# Altium schematic sheet main.SchDoc: GMAO IoT
size A3; Author: Alejandro Lemos; Organization: Protipark; Address1: Somewhere; Address2: Colombia; Address4: Open Hardware; DocumentNumber: 1; Revision: A; SheetNumber: 1; SheetTotal: 1
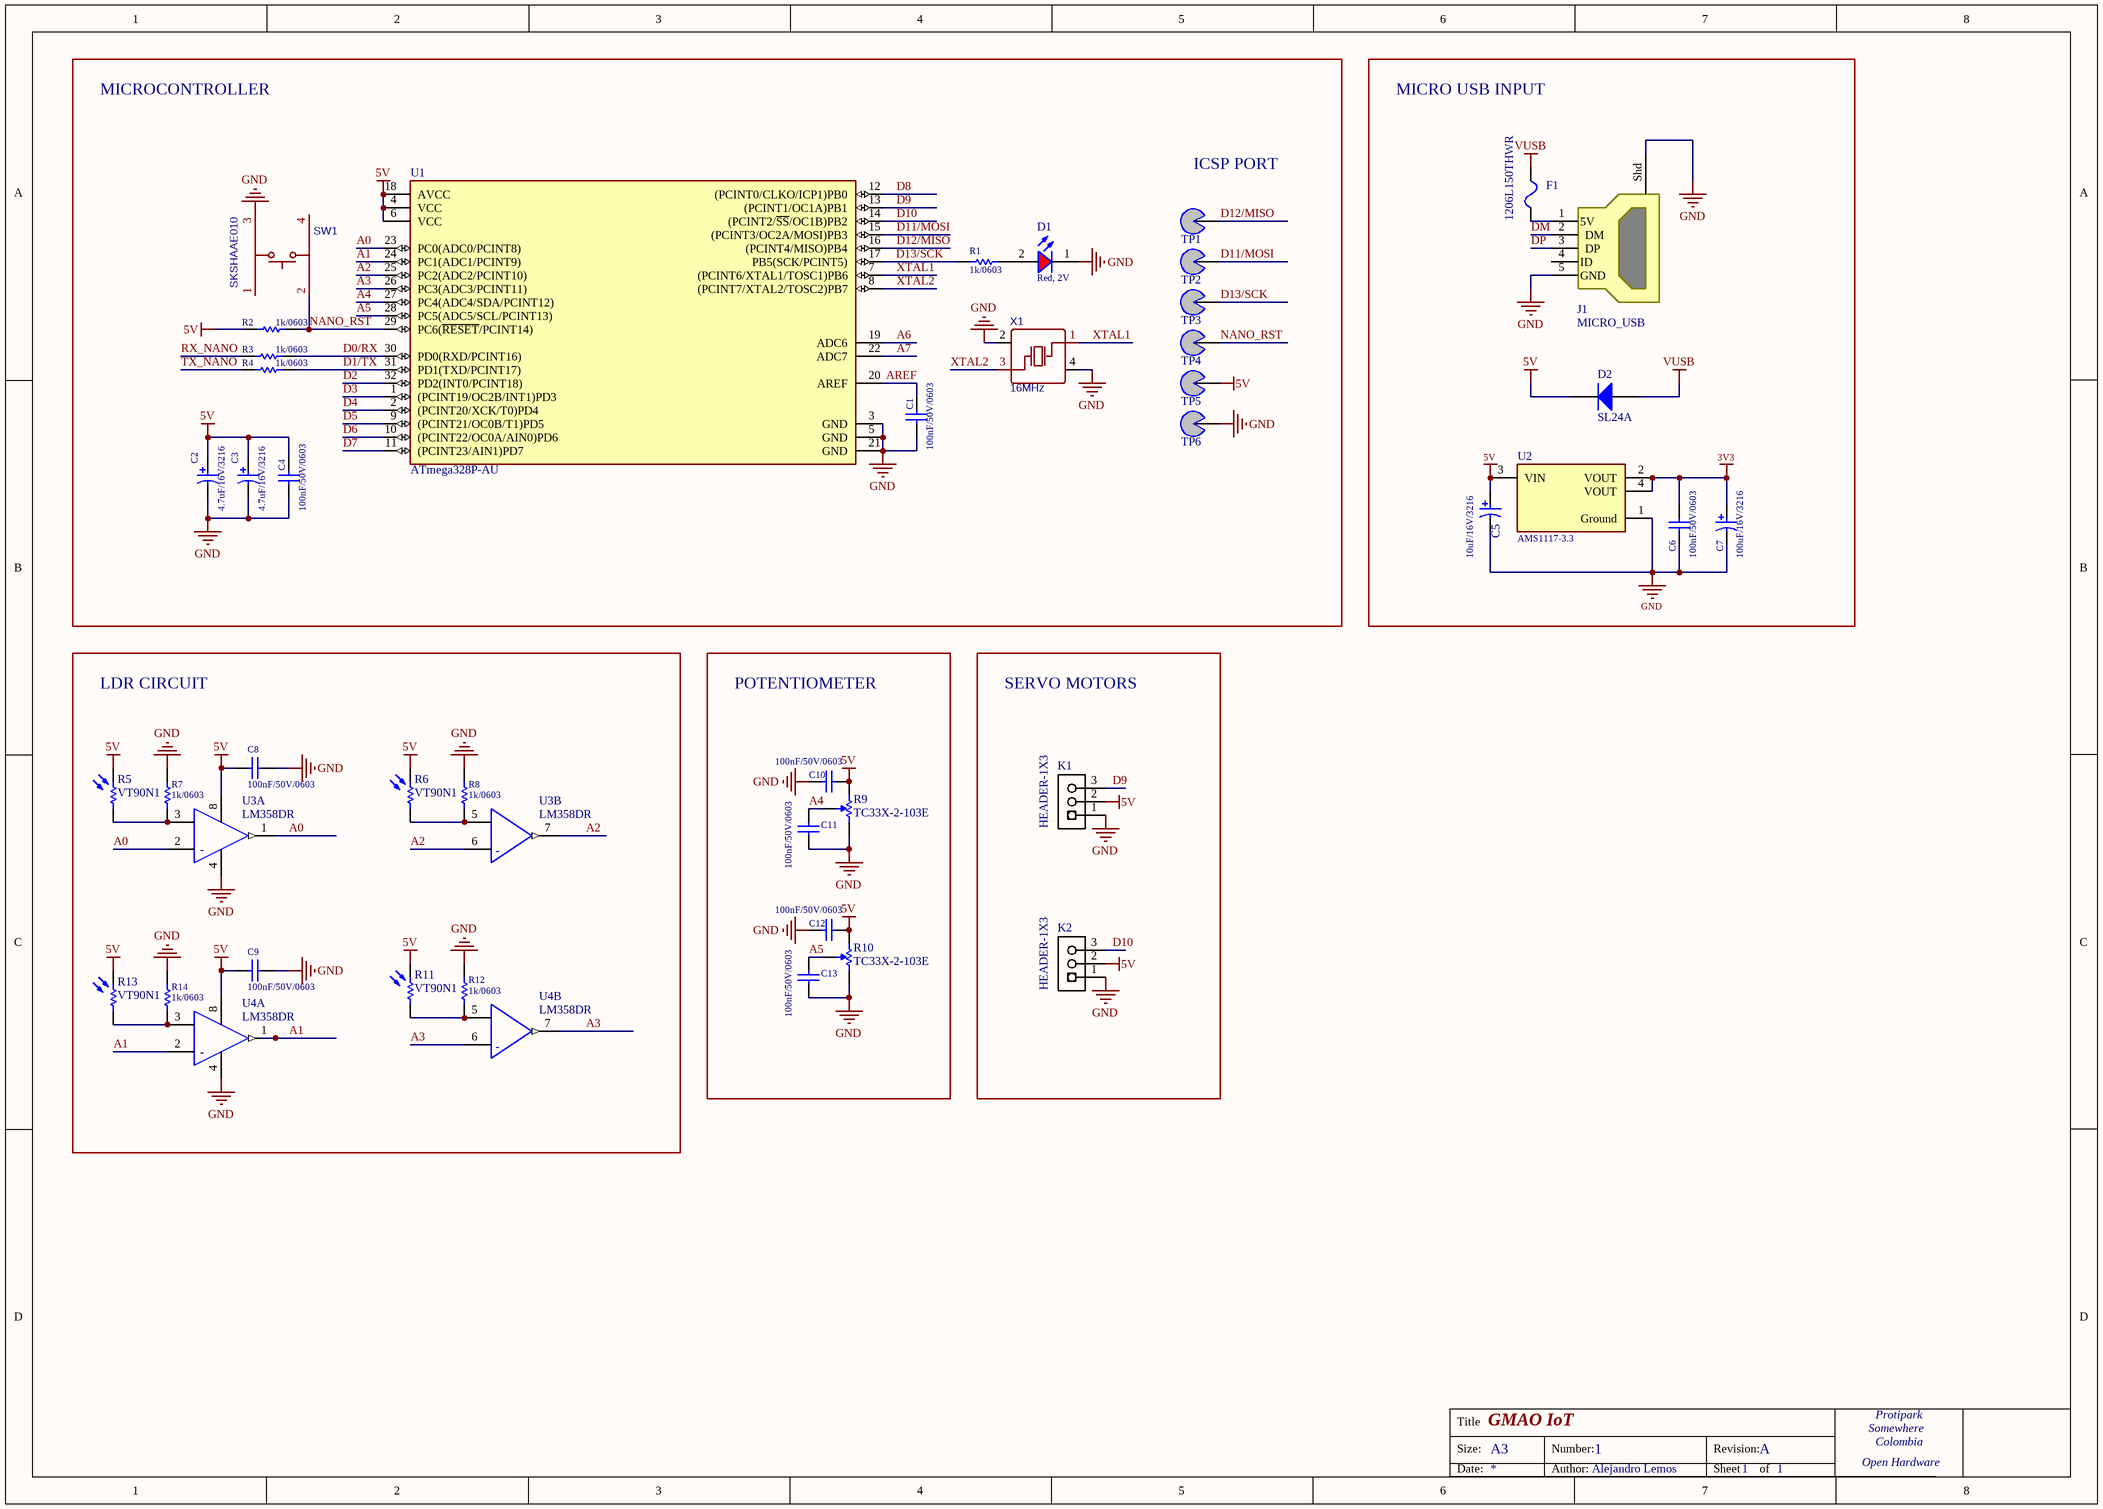
[diagram p0: main.SchDoc]

## Parts
C1  100nF/50V/0603  [C0603_L]
C2  4.7uF/16V/3216  [KEMT-T491-A_L]
C3  4.7uF/16V/3216  [KEMT-T491-A_L]
C4  100nF/50V/0603  [C0603_L]
C5  10uF/16V/3216  [KEMT-T491-A_L]
C6  100nF/50V/0603  [C0603_L]
C7  100uF/16V/3216  [KEMT-T491-A_L]
C8  100nF/50V/0603  [C0603_L]
C9  100nF/50V/0603  [C0603_L]
C10  100nF/50V/0603  [C0603_L]
C11  100nF/50V/0603  [C0603_L]
C12  100nF/50V/0603  [C0603_L]
C13  100nF/50V/0603  [C0603_L]
D1  Red, 2V  [WL-SMCW_0603_H=0.7mm]
D2  SL24A  [GESC-GAP3SLT33-214-2_V]
F1  1206L150THWR  [R1206_L]
J1  MICRO_USB  [USB MICRO]
K1  HEADER-1X3  [HEADER-1X3]
K2  HEADER-1X3  [HEADER-1X3]
R1  1k/0603  [R0603_N]
R2  1k/0603  [R0603_N]
R3  1k/0603  [R0603_N]
R4  1k/0603  [R0603_N]
R5  VT90N1  [EXCE-VT90N1]
R6  VT90N1  [EXCE-VT90N1]
R7  1k/0603  [R0603_N]
R8  1k/0603  [R0603_N]
R9  TC33X-2-103E  [BOUR-TC33X-2_V]
R10  TC33X-2-103E  [BOUR-TC33X-2_V]
R11  VT90N1  [EXCE-VT90N1]
R12  1k/0603  [R0603_N]
R13  VT90N1  [EXCE-VT90N1]
R14  1k/0603  [R0603_N]
SW1  SKSHAAE010  [SW-SMD_4P-L3.2-W2.9-P2.20-LS3.4]
TP1  Test_Point  [TESTPOINT_PROG]  (value not drawn)
TP2  Test_Point  [TESTPOINT_PROG]  (value not drawn)
TP3  Test_Point  [TESTPOINT_PROG]  (value not drawn)
TP4  Test_Point  [TESTPOINT_PROG]  (value not drawn)
TP5  Test_Point  [TESTPOINT_PROG]  (value not drawn)
TP6  Test_Point  [TESTPOINT_PROG]  (value not drawn)
U1  ATmega328P-AU  [FP-32A-MFG]
U2  AMS1117-3.3  [FP-AMS1117-IPC_C]
U3  LM358DR  [FP-D0008A-MFG]  (parts A,B of 2)
U4  LM358DR  [FP-D0008A-MFG]  (parts A,B of 2)
X1  16MHz  [CRYSTAL-SMD_4P-L3.2-W2.5-BL]

## Blocks framed on the sheet
MICRO USB INPUT: C5-C7 D2 F1 J1 U2
LDR CIRCUIT: C8 C9 R5-R8 R11-R14 U3 U4
POTENTIOMETER: C10-C13 R9 R10
SERVO MOTORS: K1 K2

## Nets
3V3: C6.2 C7.1 U2.2(VOUT) U2.4(VOUT)
5V: C2.1 C3.1 C4.2 C5.1 C8.2 C9.2 C10.2 C12.2 D2.2(K) K1.2 K2.2 R2.1 R5.2 R6.2 R9.1 R10.1 R11.2 R13.2 TP5.0(TP) U1.4(VCC) U1.6(VCC) U1.18(AVCC) U2.3(VIN) U3.8(V+) U4.8(V+)
GND: C1.2 C2.2 C3.2 C4.1 C5.2 C6.1 C7.2 C8.1 C9.1 C10.1 C11.1 C12.1 C13.1 D1.1(K) J1.5(GND) J1.Shd K1.1 K2.1 R7.1 R8.1 R9.3 R10.3 R12.1 R14.1 SW1.3 TP6.0(TP) U1.3(GND) U1.5(GND) U1.21(GND) U2.1(Ground) U3.4(V-) U4.4(V-) X1.2(GND) X1.4(GND)
VUSB: D2.1(A) F1.2
A0: U1.23(PC0(ADC0/PCINT8)) U3.1(1OUT) U3.2(IN1-)
A1: U1.24(PC1(ADC1/PCINT9)) U4.1(1OUT) U4.2(IN1-)
A2: U1.25(PC2(ADC2/PCINT10)) U3.6(IN2-) U3.7(2OUT)
A3: U1.26(PC3(ADC3/PCINT11)) U4.6(IN2-) U4.7(2OUT)
A4: C11.2 R9.2 U1.27(PC4(ADC4/SDA/PCINT12))
A5: C13.2 R10.2 U1.28(PC5(ADC5/SCL/PCINT13))
A6: U1.19(ADC6)
A7: U1.22(ADC7)
AREF: C1.1 U1.20(AREF)
D0/RX: R3.2 U1.30(PD0(RXD/PCINT16))
D1/TX: R4.2 U1.31(PD1(TXD/PCINT17))
D2: U1.32(PD2(INT0/PCINT18))
D3: U1.1((PCINT19/OC2B/INT1)PD3)
D4: U1.2((PCINT20/XCK/T0)PD4)
D5: U1.9((PCINT21/OC0B/T1)PD5)
D6: U1.10((PCINT22/OC0A/AIN0)PD6)
D7: U1.11((PCINT23/AIN1)PD7)
D8: U1.12((PCINT0/CLKO/ICP1)PB0)
D9: K1.3 U1.13((PCINT1/OC1A)PB1)
D10: K2.3 U1.14((PCINT2/~{SS}/OC1B)PB2)
D11/MOSI: TP2.0(TP) U1.15((PCINT3/OC2A/MOSI)PB3)
D12/MISO: TP1.0(TP) U1.16((PCINT4/MISO)PB4)
D13/SCK: R1.2 TP3.0(TP) U1.17(PB5(SCK/PCINT5))
DM: J1.2(DM)
DP: J1.3(DP)
NANO_RST: R2.2 SW1.2 TP4.0(TP) U1.29(PC6(~{RESET}/PCINT14))
RX_NANO: R3.1
TX_NANO: R4.1
XTAL1: U1.7((PCINT6/XTAL1/TOSC1)PB6) X1.1(OSC1)
XTAL2: U1.8((PCINT7/XTAL2/TOSC2)PB7) X1.3(OSC2)
NetD1_2: D1.2(A) R1.1
NetF1_1: F1.1 J1.1(5V)
NetR5_1: R5.1 R7.2 U3.3(IN1+)
NetR6_1: R6.1 R8.2 U3.5(IN2+)
NetR11_1: R11.1 R12.2 U4.5(IN2+)
NetR13_1: R13.1 R14.2 U4.3(IN1+)

Not connected (* = marked no-connect by the designer): J1 4(ID); SW1 1 4

## Notes on the sheet
- MICROCONTROLLER
- (near TP1) ICSP PORT
- Title
- Size:
- A3
- Number:
- Revision:
- Date:
- Author:
- Sheet
- of
- (in symbol CMP-1685-00009-2, part A) -
- (in symbol CMP-1685-00009-2, part B) -

## Library data of the parts
C1 C4 C6 C8-C13 = C_SMD: Value: 100nF/50V/0603
C2 C3 C5 C7 = CMP-2000-07187-1: Tantalum Capacitor, 2.2 uF, +/- 10%, 16 V, -55 to 125 degC, 2-Pin SMD, RoHS, Tape and Reel; Manufacturer: Kemet; Capacitance: 2200000pF; Product Depth (mm): 1.6mm; DCL: 0.4uA; Wire Form: NotRequired; Case Style: Molded; ESR: 6ohm; Polarity: Polar; Product Length (mm): 3.2mm; Voltage: 16VDC; Lead Spacing (nom): NotRequiredmm; DF: 6%; Rad Hardened: No; Operating Temp Range: -55Cto125C; Datasheet Version: 10/2016; Packaging: TapeandReel; Mounting Style: SurfaceMount; Manufacturer URL: http://www.kemet.com/; Seal: NotRequired; Product Height (mm): 1.6mm; Construction: SMTChip; Length W/Weld: NotRequiredmm; Package Reference: T491-A; Package Description: 2-Pin Surface Mount Device, Body 3.2 x 1.6 mm; Tolerance (+ or -): 10%; Length W/Weld (max): NotRequiredmm; Insulation: NotRequired; Mounting Technology: SurfaceMount; Package / Case: 3216-18; Seated Plane Height: NotRequiredmm; Case Code: A; Datasheet URL: http://capacitoredge.kemet.com/capedge2/DataSheet/Datasheet-T491A225K016AT.pdf?pn=T491A225K016AT; Product Diameter (mm): NotRequiredmm; Failure Rate: NotRequired
D1 = 150060RS75000: WL-SMCW SMT Mono-color Chip LED Waterclear, size 0603, Red, 2V, 140deg; Chip Technology: AlInGaP; Dominant Wavelength typ.: 625nm; Luminous Intensity typ.: 250mcd; Peak Wavelength typ.: 630nm; Viewing Angle: 140deg; ComponentLink1Description: Manufacturer; ComponentLink1URL: http://www.we-online.de; ComponentLink2URL: https://www.we-online.com/catalog/datasheet/150060RS75000.pdf; ComponentLink2Description: Datasheet; Forward Voltage typ.: 2V; Emitting Color: Red; Mounting Technology: SMT; Operating Temperature: -40 to +85degC; Published Date: December 2019; Part Number: 150060RS75000; Packaging: Tape and Reel; Size: 0603; Publisher: Wurth Elektronik
D2 = CMP-2000-05135-2: 40V 2A 420mV @ 2A SMA(DO-214AC) Schottky Barrier Diodes (SBD) RoHS; Pd - Power Dissipation: 25W; Configuration: Single; Vrrm - Repetitive Reverse Voltage: 3300V; Unit Weight: 0.003284oz; trr - Reverse Recovery time: 60ns; Brand: GeneSiCSemiconductor; Package Version: Rev. 1, 11/2013; Ir - Reverse Current: 100uA; Ifsm - Forward Surge Current: 10A; Vf - Forward Voltage: 4V; If - Forward Current: 0.3A; Product: SchottkySiliconCarbideDiodes; Maximum Operating Temperature: +175C; RoHS: True; Packaging: Reel; Datasheet URL: https://datasheet.ciiva.com/24141/gap3slt33-214-271329-24141300.pdf; Minimum Operating Temperature: -55C; Package URL: https://datasheet.ciiva.com/24141/gap3slt33-214-271329-24141300.pdf; Factory Pack Quantity: 2500; Package Description: 2-Pin Chip, Body 4.57 x 3.94 mm; Package / Case: DO-214AA; Mounting Style: SMD/SMT; Operating Temperature Range: -55Cto+175C; Manufacturer: GeneSiCSemiconductor; Datasheet Version: Rev. 1, 11/2013; Technology: SiC; Product Category: SchottkyDiodes&Rectifiers; Manufacturer URL: http://www.genesicsemi.com/; Series: GAP3SLT33
F1 = 1206L150THWR: FUSE PTC RESET 8V 1.50A 1206; Manufacturer: Littelfuse Inc; Current - Max: 100A; Current - Hold (Ih) (Max): 1.5A; Current - Trip (It): 3A; R Min/Max: 0.040 ~ 0.120 Ohm; Time to Trip: 0.3s; Supplier 1: Digi-Key; Manufacturer Part Number: 1206L150THWR; RoHS: RoHS Compliant; Category: Circuit Protection; Stock 1: 8140; Pricing 1: 1=0.49, 10=0.462, 25=0.4256, 50=0.3892, 100=0.3234, 250=0.294, 500=0.2492, 1000=0.2198 (USD); Packaging: Cut Tape (CT); Voltage - Max: 8V; Package / Case: 1206 (3216 Metric), Concave, Long Side Terminals; ComponentLink1URL: http://www.littelfuse.com/~/media/electronics/datasheets/resettable_ptcs/littelfuse_ptc_1206l_datasheet.pdf.pdf; ComponentLink1Description: http://www.littelfuse.com/~/media/electronics/datasheets/resettable_ptcs/littelfuse_ptc_1206l_datasheet.pdf.pdf; Supplier Part Number 1: F3372CT-ND
J1 = MICRO_USB: CONN USB MICRO B RECPT SMT R/A; Manufacturer: FCI; Manufacturer Part Number: 10118194-0001LF; Connector Type: USB - micro B; Number of Contacts: 5; Gender: Receptacle; Specifications: USB 2.0; Supplier 1: Digi-Key; RoHS: RoHS Compliant; Category: Connectors, Interconnects; Stock 1: 9139; Pricing 1: 1=0.46, 10=0.433, 25=0.3712, 50=0.3156, 100=0.3032, 250=0.27224, 500=0.25988 (USD); Packaging: Cut Tape (CT); Mounting Type: Surface Mount, Right Angle, Horizontal; Features: Shielded, Solder Retention; Ingress Protection: -; ComponentLink1URL: http://portal.fciconnect.com/Comergent//fci/drawing/10118194.pdf; ComponentLink1Description: http://portal.fciconnect.com/Comergent//fci/drawing/10118194.pdf; Supplier Part Number 1: 609-4618-1-ND
R1-R4 R7 R8 R12 R14 = R_SMD: Value: 1k/0603
R5 R6 R11 R13 = CMP-2000-07406-1: Photoconductive Resistor, 200 kOhm, 100 V, 80 mW, -40 to 75 degC, 2-Pin THD, RoHS; Manufacturer: Excelitas Technology; SVHC: Cadmiumchloride(15-Jun-2015); Power Rating: 80mW; Resistance @ Lux: 12kohm; Voltage Rating: 100V; Product Range: -; Datasheet Version: 09/2006; Resistor Case Style: -; Operating Temperature Max: 75°C; Package Reference: VT90N1; Datasheet URL: http://datasheet.octopart.com/VT90N1-Excelitas-datasheet-10388451.pdf; Mounting Technology: ThroughHole; Operating Temperature Min: -40°C; Dark Resistance: 200kohm; Package Description: 2-Pin Through Hole Device, Body Width 4.17 mm (Max), Height 2.29 mm; Manufacturer URL: http://www.excelitas.com/Pages/Index.aspx; Packaging: Each
R9 R10 = CMP-2100-03695-1: Trimming Potentiometer, 10000 Ohm, -40 to 100 degC, 3-Pin SMD, RoHS, Tape and Reel; Manufacturer: Bourns; Tolerance: 25%; Max Power Dissipation: 100mW; Number of Turns: 1; Resistance: 10KOhm; Temperature Coefficient: 250ppm/degreesC; Voltage Rating (DC): 50V; Datasheet URL: http://www.bourns.com/docs/Product-Datasheets/TC33.pdf; Composition: Potentiometer; Package Description: 3-Pin Surface Mount Device, Body 3.8 x 3.6 mm; Weight: 29.4mg; Power Rating: 100mW; Termination: FootPrint; Manufacturer URL: http://www.bourns.com/; Width: 0.118inch; Height: 0.047inch; Military Standard: Not; Radiation Hardening: No; Colour: Silver; Case/Package: SMD/SMT; Depth: 3.8mm; Min Operating Temperature: -40degC; Lead Free: LeadFree; Datasheet Version: 42583.0; REACH SVHC: NoSVHC; Length: 3mm; RoHSCompliant: true; Contact Plating: Silver; Taper: Linear; Packaging: TapeandReel; Mount: SurfaceMount; Max Operating Temperature: 100degC; Package Reference: TC33X-2; Package Quantity: 2500
SW1 = SKSHAAE010: SWITCH; BOM_Manufacturer: ALPS Electric; Contributor: LCSC; BOM_Supplier: LCSC; BOM_Supplier Part: C262415; BOM_Manufacturer Part: SKSHAAE010; spicePre: S; spiceSymbolName: SKSHAAE010
U1 = CMP-06276-000013-1: IC MCU 8BIT 32KB FLASH 32TQFP; Manufacturer: Microchip; Nominal Supply Current: 0.04-5.2mA; Number Of Timers/Counters: 3; Number Of Adc Channels: 8; Number Of I2C Channels: 1; Min Supply Voltage: 1.8V; Standoff Height: 0.05mm; Data Bus Width: 8bits; Ram Size: 2KBytes; Max Supply Voltage: 5.5V; Interface: I2C,SPI,UART,USART,2-Wire; Frequency: 20MHz; Number Of Pwm Channels: 6; Memory Size: 32KBytes; Number Of I/Os: 23; Core Architecture: AVR; Temperature: -40°C to +85°C; Number Of Spi Channels: 1; Digikey Description: IC MCU 8BIT 32KB FLASH 32TQFP; Category: IC; RoHS: TRUE; Memory Type: FLASH; Package: 32A; ComponentLink2Description: Datasheet; Number Of Uart Channels: 1; Temperature Range High: +85°C; Octopart: https://octopart.com/atmega328p-au-microchip-77760215; Footprint Url: http://ww1.microchip.com/downloads/en/appnotes/atmel-8826-seeprom-pcb-mounting-guidelines-surface-mount-packages-applicationnote.pdf; Lead Free: Yes; Device Class L1: Integrated Circuits (ICs); Device Class L2: Embedded Processors and Controllers; Ipc Land Pattern Name: QFP80P900X900X120-32; Number Of A/D Converters: 1; Number Of Cores: 1; Automotive: No; Temperature Range Low: -40°C; Mouser Description: ATmega Series 32 KB Flash 2 KB SRAM 20 MHz 8-Bit Microcontroller - TQFP-32; ComponentLink2URL: http://ww1.microchip.com/downloads/en/DeviceDoc/ATmega48A-PA-88A-PA-168A-PA-328-P-DS-DS40002061A.pdf; Height: 1.2mm; Manufacturer Part Number: ATmega328P-AU; Device Class L3: Microcontrollers
U2 = CMP-209535-000001-1: LDO Voltage Regulators 1A, 3.3V; Manufacturer: Advanced Monolithic Systems; Dropout Voltage: 1.1V; Output Type: Fixed; Nominal Supply Current: 5mA; Max Power Dissipation: 1.2W; Max Supply Voltage: 15V; Number Of Outputs: 1; Standoff Height: 0.64mm; Max Junction Temp: +125°C; Height: 1.8mm; Package: AMS1117; Device Class L2: Power Management ICs; ComponentLink2Description: Datasheet; ComponentLink2URL: http://www.advanced-monolithic.com/pdf/ds1117.pdf; Category: IC; RoHS: TRUE; Automotive: No; Device Class L1: Integrated Circuits (ICs); Output Current: 1A; Device Class L3: Voltage Regulators - Linear; Temperature: -40°C to +125°C; Output Voltage: 3.3V; Manufacturer Part Number: AMS1117-3.3; Temperature Range Low: -40°C; Octopart: https://octopart.com/ams1117-3.3-advanced+monolithic+systems-25899300; Lead Free: Yes; Ipc Land Pattern Name: SOT229P700X180-4; Temperature Range High: +125°C
U3 U4 = CMP-1685-00009-2: IC OPAMP GP 2 CIRCUIT 8SOIC; Output Current: 30mA; Min Dual Supply Voltage: 1.5V; Input Offset Voltage (Vos): 7mV; Power Supply Rejection Ratio (PSRR): 65dB; Unity Gain Bandwidth Product: 700kHz; Number of Channels: 2; Min Supply Voltage: 3V; Max Dual Supply Voltage: 16V; Dual Supply Voltage: 9V; Max Supply Voltage: 32V; Nominal Supply Current: 1.2mA; Slew Rate: 0.3V/µs; Input Bias Current: 250nA; Voltage Gain: 100dB; Operating Supply Current: 1mA; REACH SVHC: No SVHC; Package Quantity: 2500; Width: 3.91mm; Max Operating Temperature: 70°C; Min Operating Temperature: 0°C; Mount: Surface Mount; Length: 4.9mm; Radiation Hardening: No; Case/Package: SOIC; Lead Free: Lead Free; Number of Elements: 2; Packaging: Tape and Reel; Output Current per Channel: 30mA; Number of Circuits: 2; Bandwidth: 700kHz; Operating Supply Voltage: 16V; Gain Bandwidth Product: 700kHz; Number of Pins: 8; Number of Amplifiers: 2; Height: 1.58mm; Common Mode Rejection Ratio: 65dB; Contact Plating: Gold
X1 = 16MHz: BOM_Manufacturer: YXC; BOM_Manufacturer Part: X322516MOB4SI; nameAlias: Frequency; BOM_Paste Type: Extended Part; BOM_Supplier: LCSC; BOM_Supplier Part: C12668; BOM_JLCPCB Part Class: Extended Part; spicePre: X; spiceSymbolName: X322516MOB4SI
K1 K2 = HEADER-1X3: Supplier 1: Digi-Key; Supplier Part Number 1: S1011E-36-ND